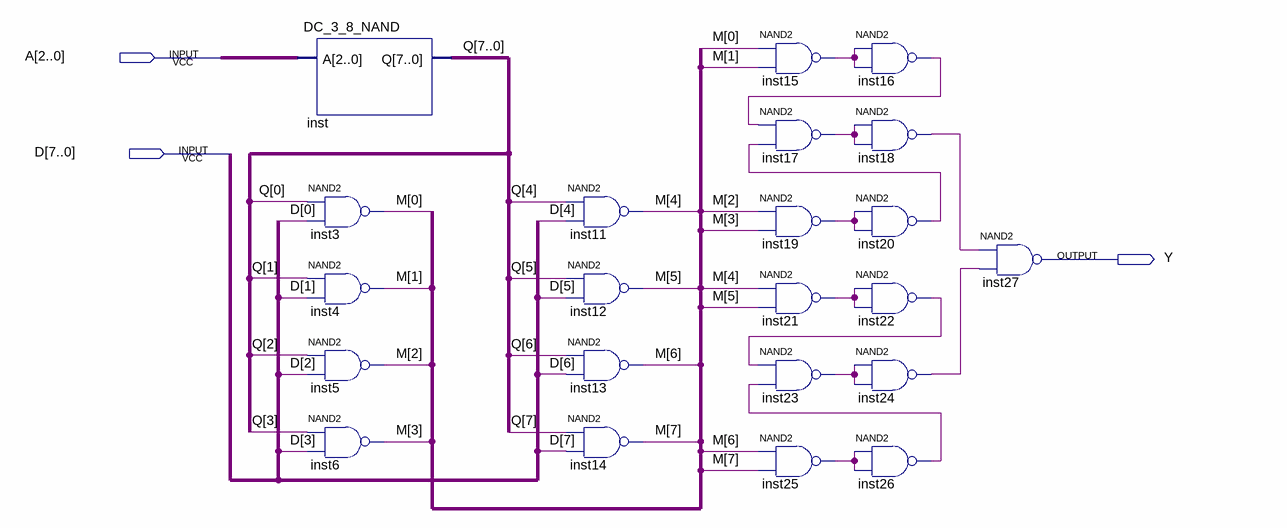
[diagram p0: schematic sheet]
// Quartus schematic MUX_8-1_NAND.bdf as structural Verilog: 22 symbols, 3 pins
module \MUX_8-1_NAND  (
  input  [2:0] A,
  input  [7:0] D,
  output Y
);

  wire inst15_out, inst16_out, inst17_out, inst18_out, inst19_out, inst20_out, inst21_out, inst22_out,
       inst23_out, inst24_out, inst25_out, inst26_out;
  wire [7:0] M, Q;

  DC_3_8_NAND inst (.A(A), .Q(Q));
  nand inst3 (M[0], Q[0], D[0]);
  nand inst4 (M[1], Q[1], D[1]);
  nand inst5 (M[2], Q[2], D[2]);
  nand inst6 (M[3], Q[3], D[3]);
  nand inst11 (M[4], Q[4], D[4]);
  nand inst12 (M[5], Q[5], D[5]);
  nand inst13 (M[6], Q[6], D[6]);
  nand inst14 (M[7], Q[7], D[7]);
  nand inst15 (inst15_out, M[0], M[1]);
  nand inst17 (inst17_out, inst16_out, inst20_out);
  nand inst19 (inst19_out, M[2], M[3]);
  nand inst21 (inst21_out, M[4], M[5]);
  nand inst23 (inst23_out, inst22_out, inst26_out);
  nand inst25 (inst25_out, M[6], M[7]);
  nand inst16 (inst16_out, inst15_out, inst15_out);
  nand inst18 (inst18_out, inst17_out, inst17_out);
  nand inst20 (inst20_out, inst19_out, inst19_out);
  nand inst22 (inst22_out, inst21_out, inst21_out);
  nand inst24 (inst24_out, inst23_out, inst23_out);
  nand inst26 (inst26_out, inst25_out, inst25_out);
  nand inst27 (Y, inst18_out, inst24_out);
endmodule
